# Altium schematic sheet G1-CM4.SchDoc
size A2; SheetNumber: 1; SheetTotal: 4
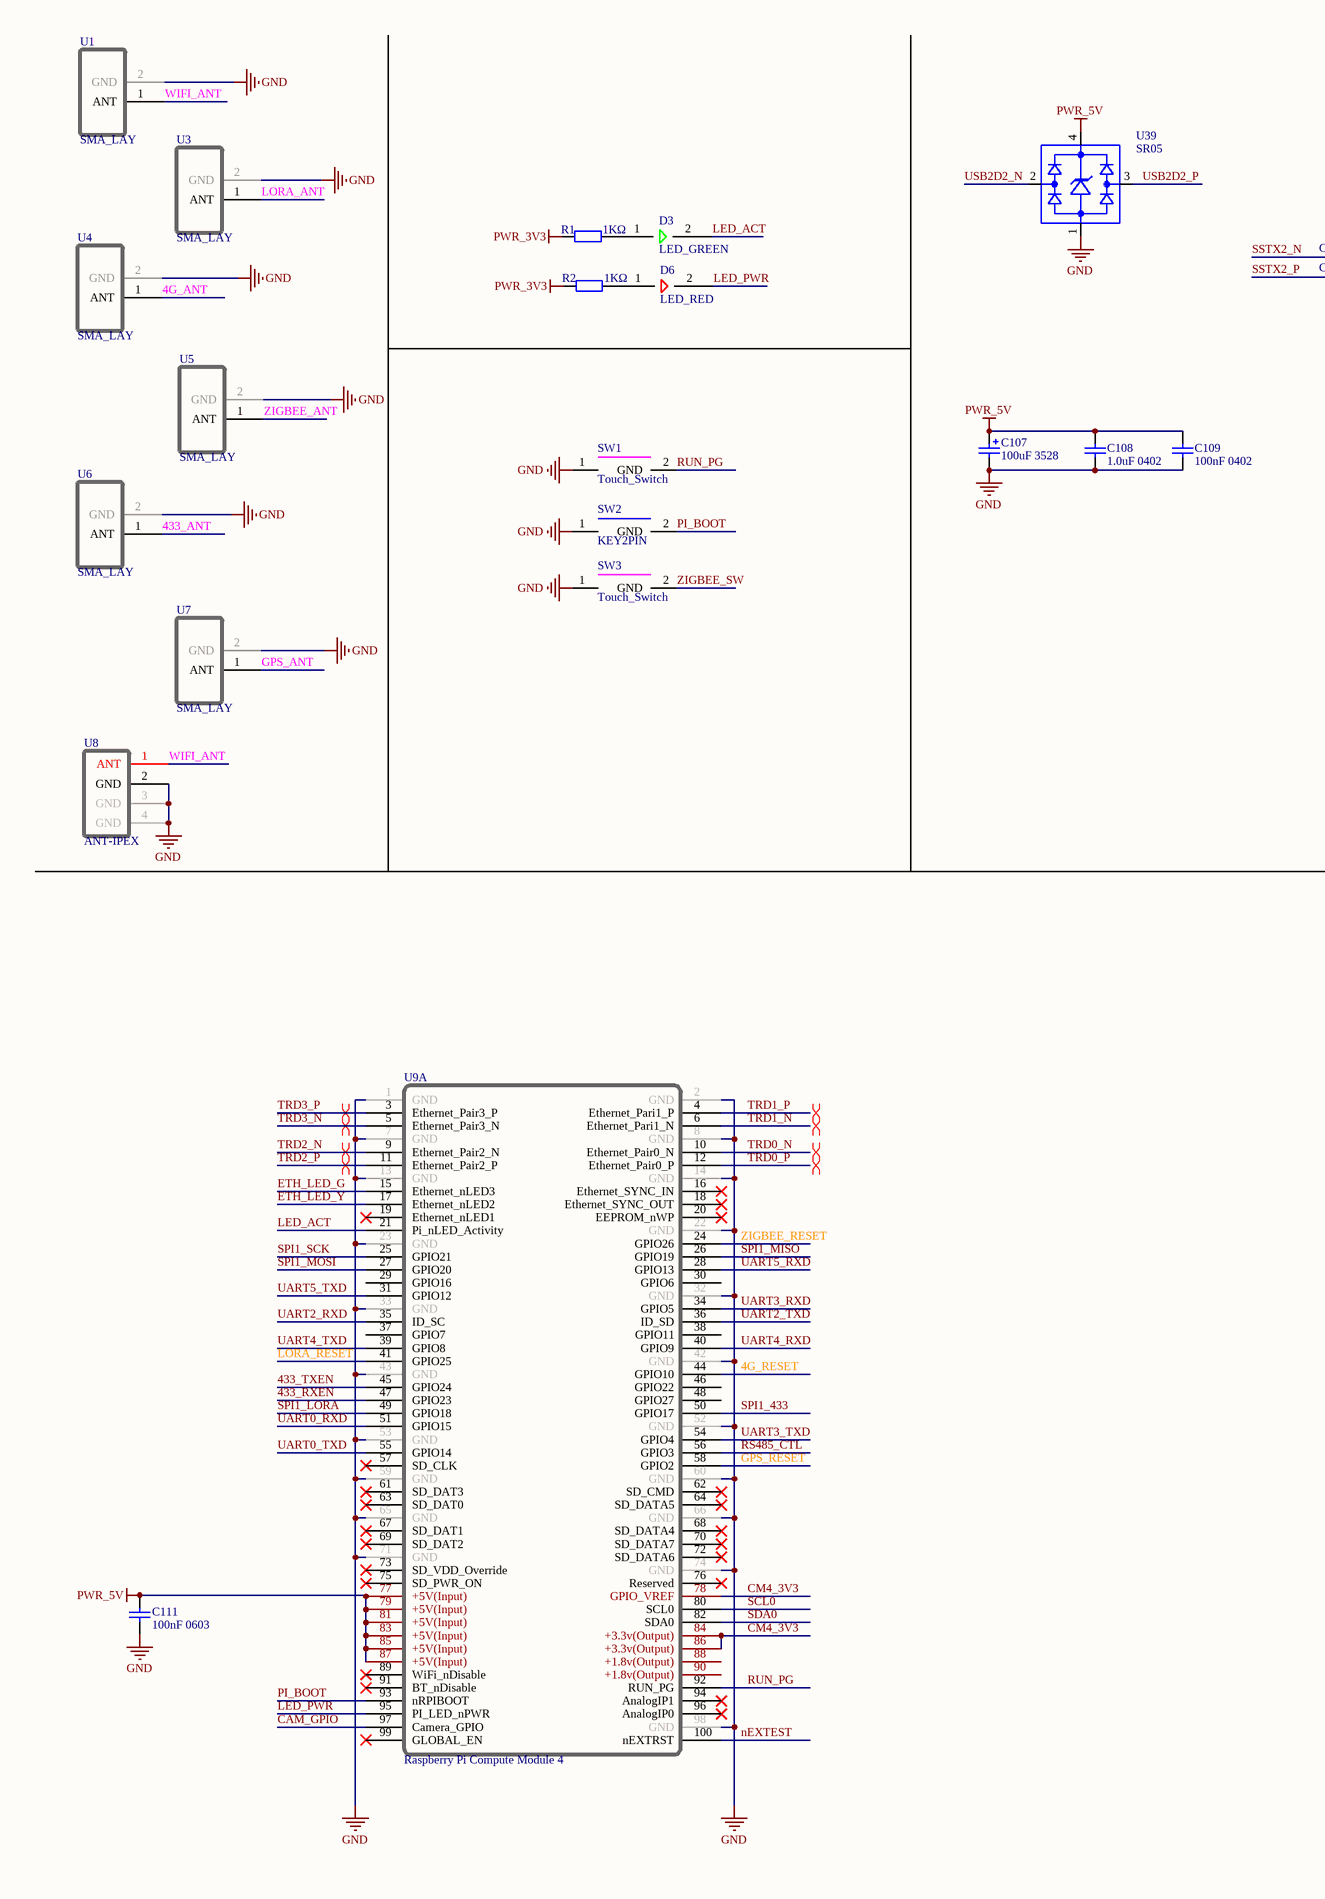
[diagram p0: G1-CM4.SchDoc, left]
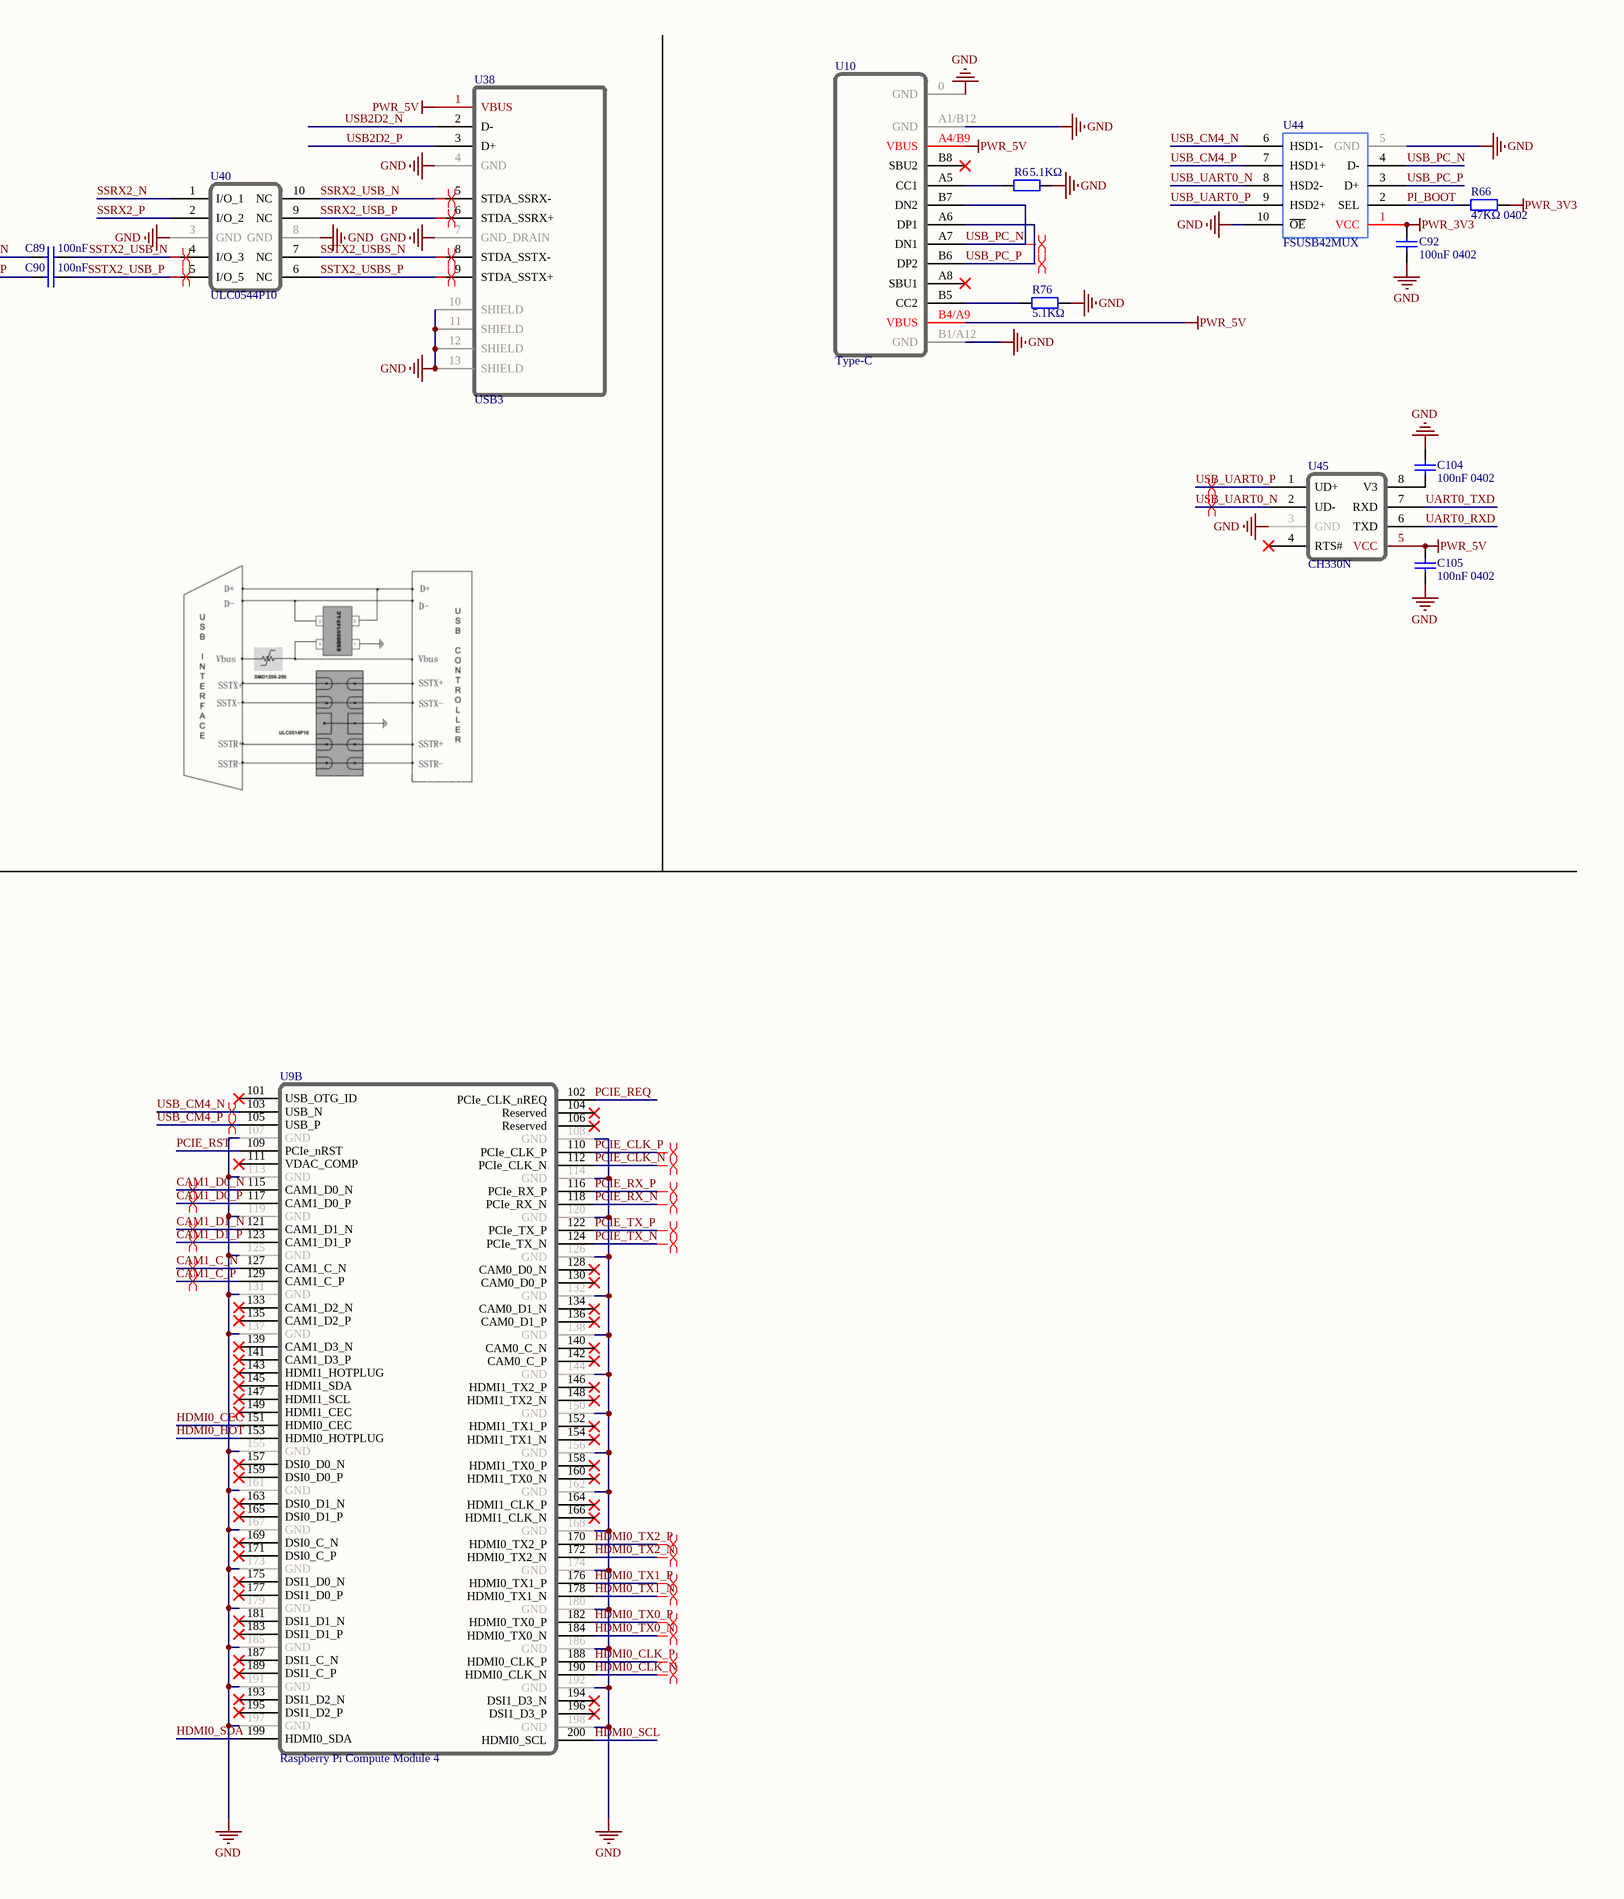
[diagram p1: G1-CM4.SchDoc, right]

## Parts
C89  100nF  [0402_C]
C90  100nF  [0402_C]
C92  100nF 0402  [0402_C]
C104  100nF 0402  [0402_C]
C105  100nF 0402  [0402_C]
C107  100uF 3528  [CASE-B_3528]
C108  1.0uF 0402  [0402_C]
C109  100nF 0402  [0402_C]
C111  100nF 0603  [0603_C]
D3  LED_GREEN  [LED_SIDE]
D6  LED_RED  [LED_SIDE]
R1  1KΩ  [0402_R]
R2  1KΩ  [0402_R]
R6  5.1KΩ  [0402_R]
R66  47KΩ 0402  [0402_R]
R76  5.1KΩ  [0402_R]
SW1  Touch_Switch  [Touch_Switch]
SW2  KEY2PIN  [KEY2PIN]
SW3  Touch_Switch  [Touch_Switch]
U1  SMA_LAY  [SMA-LAY]
U3  SMA_LAY  [SMA-LAY]
U4  SMA_LAY  [SMA-LAY]
U5  SMA_LAY  [SMA-LAY]
U6  SMA_LAY  [SMA-LAY]
U7  SMA_LAY  [SMA-LAY]
U8  ANT-IPEX  [ANT-IPEX]
U9  Raspberry Pi Compute Module 4  [CM4T-DF40HC(3.0)-100DS]  (parts A,B of 2)
U10  Type-C  [Type-C-16P]
U38  USB3  [USB3]
U39  SR05  [SR05]
U40  ULC0544P10  [ULC0544P10]
U44  FSUSB42MUX  [FSUSB42MUX]
U45  CH330N  [CH330N]

## Nets
GND: C92.1 C104.2 C105.1 C107.2 C108.1 C109.1 C111.1 R6.2 R76.2 SW1.1 SW2.1 SW3.1 U1.2(GND) U3.2(GND) U4.2(GND) U5.2(GND) U6.2(GND) U7.2(GND) U8.2(GND) U8.3(GND) U8.4(GND) U9.1(GND) U9.2(GND) U9.7(GND) U9.8(GND) U9.13(GND) U9.14(GND) U9.22(GND) U9.23(GND) U9.32(GND) U9.33(GND) U9.42(GND) U9.43(GND) U9.52(GND) U9.53(GND) U9.59(GND) U9.60(GND) U9.65(GND) U9.66(GND) U9.71(GND) U9.74(GND) U9.98(GND) U9.107(GND) U9.108(GND) U9.113(GND) U9.114(GND) U9.119(GND) U9.120(GND) U9.125(GND) U9.126(GND) U9.131(GND) U9.132(GND) U9.137(GND) U9.138(GND) U9.144(GND) U9.150(GND) U9.155(GND) U9.156(GND) U9.161(GND) U9.162(GND) U9.167(GND) U9.168(GND) U9.173(GND) U9.174(GND) U9.179(GND) U9.180(GND) U9.185(GND) U9.186(GND) U9.191(GND) U9.192(GND) U9.197(GND) U9.198(GND) U10.0(GND) U10.A1/B12(GND) U10.B1/A12(GND) U38.4(GND) U38.7(GND_DRAIN) U38.10(SHIELD) U38.11(SHIELD) U38.12(SHIELD) U38.13(SHIELD) U39.1 U40.3(GND) U40.8(GND) U44.5(GND) U44.10(~{OE}) U45.3(GND)
PWR_3V3: C92.2 R1.1 R2.1 R66.1 U44.1(VCC)
PWR_5V: C105.2 C107.1 C108.2 C109.2 C111.2 U9.77(+5V(Input)) U9.79(+5V(Input)) U9.81(+5V(Input)) U9.83(+5V(Input)) U9.85(+5V(Input)) U9.87(+5V(Input)) U10.A4/B9(VBUS) U10.B4/A9(VBUS) U38.1(VBUS) U39.4 U45.5(VCC)
4G_ANT: U4.1(ANT)
4G_RESET: U9.44(GPIO10)
433_ANT: U6.1(ANT)
433_RXEN: U9.47(GPIO23)
433_TXEN: U9.45(GPIO24)
CAM1_C_N: U9.127(CAM1_C_N)
CAM1_C_P: U9.129(CAM1_C_P)
CAM1_D0_N: U9.115(CAM1_D0_N)
CAM1_D0_P: U9.117(CAM1_D0_P)
CAM1_D1_N: U9.121(CAM1_D1_N)
CAM1_D1_P: U9.123(CAM1_D1_P)
CAM_GPIO: U9.97(Camera_GPIO)
CM4_3V3: U9.78(GPIO_VREF) U9.84(+3.3v(Output)) U9.86(+3.3v(Output))
ETH_LED_G: U9.15(Ethernet_nLED3)
ETH_LED_Y: U9.17(Ethernet_nLED2)
GPS_ANT: U7.1(ANT)
GPS_RESET: U9.58(GPIO2)
HDMI0_CEC: U9.151(HDMI0_CEC)
HDMI0_CLK_N: U9.190(HDMI0_CLK_N)
HDMI0_CLK_P: U9.188(HDMI0_CLK_P)
HDMI0_HOT: U9.153(HDMI0_HOTPLUG)
HDMI0_SCL: U9.200(HDMI0_SCL)
HDMI0_SDA: U9.199(HDMI0_SDA)
HDMI0_TX0_N: U9.184(HDMI0_TX0_N)
HDMI0_TX0_P: U9.182(HDMI0_TX0_P)
HDMI0_TX1_N: U9.178(HDMI0_TX1_N)
HDMI0_TX1_P: U9.176(HDMI0_TX1_P)
HDMI0_TX2_N: U9.172(HDMI0_TX2_N)
HDMI0_TX2_P: U9.170(HDMI0_TX2_P)
LED_ACT: D3.2 U9.21(Pi_nLED_Activity)
LED_PWR: D6.2 U9.95(PI_LED_nPWR)
LORA_ANT: U3.1(ANT)
LORA_RESET: U9.41(GPIO25)
nEXTEST: U9.100(nEXTRST)
PCIE_CLK_N: U9.112(PCIe_CLK_N)
PCIE_CLK_P: U9.110(PCIe_CLK_P)
PCIE_REQ: U9.102(PCIe_CLK_nREQ)
PCIE_RST: U9.109(PCIe_nRST)
PCIE_RX_N: U9.118(PCIe_RX_N)
PCIE_RX_P: U9.116(PCIe_RX_P)
PCIE_TX_N: U9.124(PCIe_TX_N)
PCIE_TX_P: U9.122(PCIe_TX_P)
PI_BOOT: R66.2 SW2.2(GND) U9.93(nRPIBOOT) U44.2(SEL)
RS485_CTL: U9.56(GPIO3)
RUN_PG: SW1.2(GND) U9.92(RUN_PG)
SCL0: U9.80(SCL0)
SDA0: U9.82(SDA0)
SPI1_433: U9.50(GPIO17)
SPI1_LORA: U9.49(GPIO18)
SPI1_MISO: U9.26(GPIO19)
SPI1_MOSI: U9.27(GPIO20)
SPI1_SCK: U9.25(GPIO21)
SSRX2_N: U40.1(I/O_1)
SSRX2_P: U40.2(I/O_2)
SSRX2_USB_N: U38.5(STDA_SSRX-) U40.10(NC)
SSRX2_USB_P: U38.6(STDA_SSRX+) U40.9(NC)
SSTX2_N: C89.1
SSTX2_P: C90.1
SSTX2_USB_N: C89.2 U40.4(I/O_3)
SSTX2_USB_P: C90.2 U40.5(I/O_5)
SSTX2_USBS_N: U38.8(STDA_SSTX-) U40.7(NC)
SSTX2_USBS_P: U38.9(STDA_SSTX+) U40.6(NC)
TRD0_N: U9.10(Ethernet_Pair0_N)
TRD0_P: U9.12(Ethernet_Pair0_P)
TRD1_N: U9.6(Ethernet_Pari1_N)
TRD1_P: U9.4(Ethernet_Pari1_P)
TRD2_N: U9.9(Ethernet_Pair2_N)
TRD2_P: U9.11(Ethernet_Pair2_P)
TRD3_N: U9.5(Ethernet_Pair3_N)
TRD3_P: U9.3(Ethernet_Pair3_P)
UART0_RXD: U9.51(GPIO15) U45.6(TXD)
UART0_TXD: U9.55(GPIO14) U45.7(RXD)
UART2_RXD: U9.35(ID_SC)
UART2_TXD: U9.36(ID_SD)
UART3_RXD: U9.34(GPIO5)
UART3_TXD: U9.54(GPIO4)
UART4_RXD: U9.40(GPIO9)
UART4_TXD: U9.39(GPIO8)
UART5_RXD: U9.28(GPIO13)
UART5_TXD: U9.31(GPIO12)
USB2D2_N: U38.2(D-) U39.2
USB2D2_P: U38.3(D+) U39.3
USB_CM4_N: U9.103(USB_N) U44.6(HSD1-)
USB_CM4_P: U9.105(USB_P) U44.7(HSD1+)
USB_PC_N: U10.A7(DN1) U10.B7(DN2) U44.4(D-)
USB_PC_P: U10.A6(DP1) U10.B6(DP2) U44.3(D+)
USB_UART0_N: U44.8(HSD2-) U45.2(UD-)
USB_UART0_P: U44.9(HSD2+) U45.1(UD+)
WIFI_ANT: U1.1(ANT) U8.1(ANT)
ZIGBEE_ANT: U5.1(ANT)
ZIGBEE_RESET: U9.24(GPIO26)
ZIGBEE_SW: SW3.2(GND)
NetC104_1: C104.1 U45.8(V3)
NetD3_1: D3.1 R1.2
NetD6_1: D6.1 R2.2
NetR6_1: R6.1 U10.A5(CC1)
NetR76_1: R76.1 U10.B5(CC2)

Not connected (* = marked no-connect by the designer): U9 16(Ethernet_SYNC_IN)* 18(Ethernet_SYNC_OUT)* 19(Ethernet_nLED1)* 20(EEPROM_nWP)* 29(GPIO16) 30(GPIO6) 37(GPIO7) 38(GPIO11) 46(GPIO22) 48(GPIO27) 57(SD_CLK)* 61(SD_DAT3)* 62(SD_CMD)* 63(SD_DAT0)* 64(SD_DATA5)* 67(SD_DAT1)* 68(SD_DATA4)* 69(SD_DAT2)* 70(SD_DATA7)* 72(SD_DATA6)* 73(SD_VDD_Override)* 75(SD_PWR_ON)* 76(Reserved)* 88(+1.8v(Output)) 89(WiFi_nDisable)* 90(+1.8v(Output)) 91(BT_nDisable)* 94(AnalogIP1)* 96(AnalogIP0)* 99(GLOBAL_EN)* 101(USB_OTG_ID)* 104(Reserved)* 106(Reserved)* 111(VDAC_COMP)* 128(CAM0_D0_N)* 130(CAM0_D0_P)* 133(CAM1_D2_N)* 134(CAM0_D1_N)* 135(CAM1_D2_P)* 136(CAM0_D1_P)* 139(CAM1_D3_N)* 140(CAM0_C_N)* 141(CAM1_D3_P)* 142(CAM0_C_P)* 143(HDMI1_HOTPLUG)* 145(HDMI1_SDA)* 146(HDMI1_TX2_P)* 147(HDMI1_SCL)* 148(HDMI1_TX2_N)* 149(HDMI1_CEC)* 152(HDMI1_TX1_P)* 154(HDMI1_TX1_N)* 157(DSI0_D0_N)* 158(HDMI1_TX0_P)* 159(DSI0_D0_P)* 160(HDMI1_TX0_N)* 163(DSI0_D1_N)* 164(HDMI1_CLK_P)* 165(DSI0_D1_P)* 166(HDMI1_CLK_N)* 169(DSI0_C_N)* 171(DSI0_C_P)* 175(DSI1_D0_N)* 177(DSI1_D0_P)* 181(DSI1_D1_N)* 183(DSI1_D1_P)* 187(DSI1_C_N)* 189(DSI1_C_P)* 193(DSI1_D2_N)* 194(DSI1_D3_N)* 195(DSI1_D2_P)* 196(DSI1_D3_P)*; U10 A8(SBU1)* B8(SBU2)*; U45 4(RTS#)*

## Layout directives
differential pair: CAM1_C_N, CAM1_C_P, CAM1_D0_N, CAM1_D0_P, CAM1_D1_N, CAM1_D1_P, HDMI0_CLK_N, HDMI0_CLK_P, HDMI0_TX0_N, HDMI0_TX0_P, HDMI0_TX1_N, HDMI0_TX1_P, HDMI0_TX2_N, HDMI0_TX2_P, PCIE_CLK_N, PCIE_CLK_P, PCIE_RX_N, PCIE_RX_P, PCIE_TX_N, PCIE_TX_P, SSRX2_USB_N, SSRX2_USB_P, SSTX2_USB_N, SSTX2_USB_P, SSTX2_USBS_N, SSTX2_USBS_P, TRD0_N, TRD0_P, TRD1_N, TRD1_P, TRD2_N, TRD2_P, TRD3_N, TRD3_P, USB_CM4_N, USB_CM4_P, USB_PC_N, USB_PC_P, USB_UART0_N, USB_UART0_P

## Library data of the parts
C89 C90 C92 C104 C105 C109 = 0402 100nF (104) 10% 16V: 贴片电容; ComponentLink1Description: 供应商链接; ComponentLink1URL: http://www.szlcsc.com/product/details_1877.html; Package: 0402; Supplier: LC; SuppliersPartNumber: C1525
C107 = 3528 100uF (107) 10% 6.3V: 钽电容; ComponentLink1Description: 供应商链接; ComponentLink1URL: http://www.szlcsc.com/product/details_16815.html; Package: 3528; Supplier: LC; SuppliersPartNumber: C16133
C108 = 0402 1.0uF (105) 10% 25V: 贴片电容; ComponentLink1Description: 供应商链接; ComponentLink1URL: http://www.szlcsc.com/product/details_53938.html; Package: 0402; Supplier: LC; SuppliersPartNumber: C52923
C111 = 0603 100nF (104) 10% 50V: 贴片电容; ComponentLink1Description: 供应商链接; ComponentLink1URL: http://www.szlcsc.com/product/details_15331.html; Package: 0603; Supplier: LC; SuppliersPartNumber: C14663
D3 = LED_GREEN: LED GREEN 0603 SIDE
D6 = LED_RED: LED RED 0603 SIDE
R1 R2 = 0402 1KΩ (1001) 1%: 贴片电阻; ComponentLink1Description: 供应商链接; ComponentLink1URL: http://www.szlcsc.com/product/details_12256.html; Package: 0402; Supplier: LC; SuppliersPartNumber: C11702
R6 R76 = 0402 5.1KΩ (5101) 1%: 贴片电阻; ComponentLink1Description: 供应商链接; ComponentLink1URL: http://www.szlcsc.com/product/details_26648.html; Package: 0402; Supplier: LC; SuppliersPartNumber: C25905
R66 = 0402 47KΩ (4702) 1%: 贴片电阻; ComponentLink1Description: 供应商链接; ComponentLink1URL: http://www.szlcsc.com/product/details_26535.html; Package: 0402; Supplier: LC; SuppliersPartNumber: C25792
SW1 SW3 = Touch_Switch: Touch_Switch 2PIN
SW2 = KEY2PIN: Switch Button
U1 U3-U7 = SMA_LAY: SMA ANT LAY
U8 = ANT-IPEX: ANT
U9 = CM4
U10 = Type-C-16P
U38 = USB3: USB3.0
U40 = ULC0544P10: ESD
U44 = FSUSB42MUX: USB Switch IC 1 Channel, 10-Lead MSOP
U45 = CH330N: USB to UART